# Altium schematic sheet 恒流驱动灯板.SchDoc
size A3
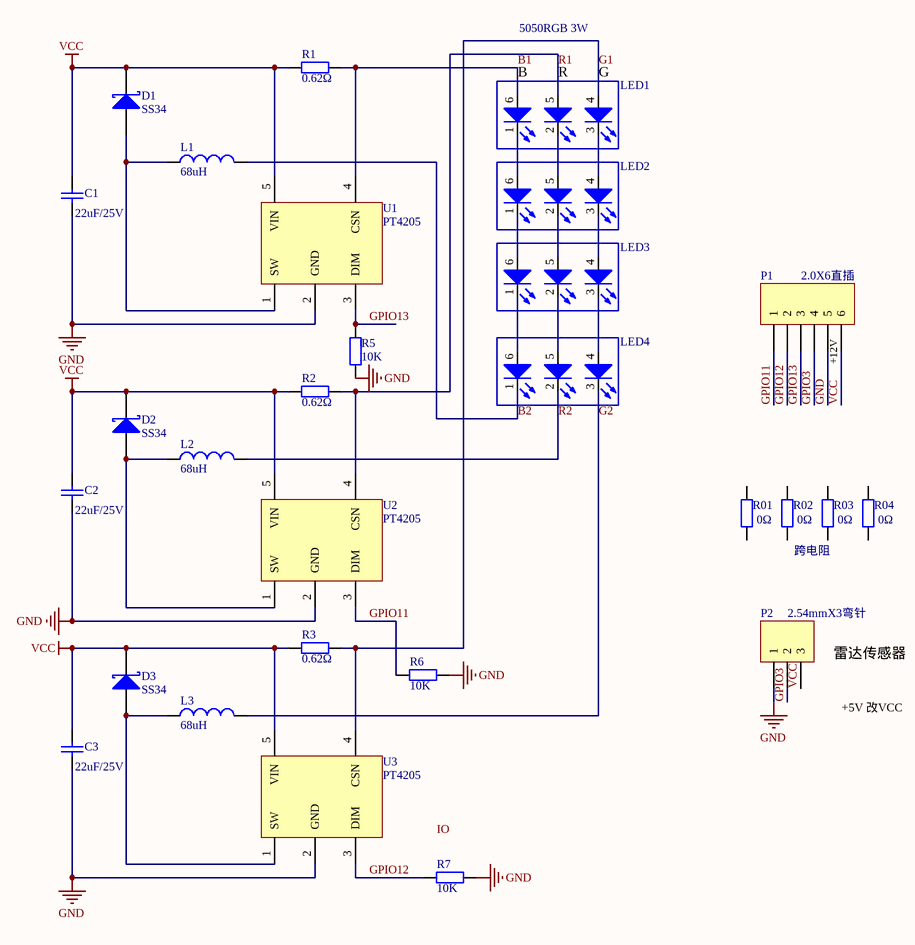
[diagram p0: 恒流驱动灯板.SchDoc]

## Parts
C1  22uF/25V  [1206]
C2  22uF/25V  [1206]
C3  22uF/25V  [1206]
D1  SS34  [SMA]
D2  SS34  [SMA]
D3  SS34  [SMA]
L1  68uH  [D电感 7X7mm]
L2  68uH  [D电感 7X7mm]
L3  68uH  [D电感 7X7mm]
LED1  5050RGB 3W  [LED 5050RGB 3W]
LED2  5050RGB 3W  [LED 5050RGB 3W]  (value not drawn)
LED3  5050RGB 3W  [LED 5050RGB 3W]  (value not drawn)
LED4  5050RGB 3W  [LED 5050RGB 3W]  (value not drawn)
P1  2.0X6直插  [2.54M6 贴焊]
P2  2.54mmX3弯针  [模块5.8G微波感应模 2]
R1  0.62Ω  [0805]
R01  0Ω  [1206]
R2  0.62Ω  [0805]
R02  0Ω  [1206]
R3  0.62Ω  [0805]
R03  0Ω  [1206]
R04  0Ω  Published: 跨电阻  [1206]
R5  10K  [0805]
R6  10K  [0805]
R7  10K  [0805]
U1  PT4205  [SOT-89-5L - 改]
U2  PT4205  [SOT-89-5L - 改]
U3  PT4205  [SOT-89-5L - 改]

## Nets
GND: C1.1 C2.1 C3.1 P1.5 P2.1 R5.2 R6.2 R7.2 U1.2(GND) U2.2(GND) U3.2(GND)
VCC: C1.2 C2.2 C3.2 D1.2(K) D2.2(K) D3.2(K) P1.6 P2.3 R1.1 R2.1 R3.1 U1.5(VIN) U2.5(VIN) U3.5(VIN)
B1: LED1.6 R1.2 U1.4(CSN)
B2: L1.2 LED4.1
G1: LED1.4 R3.2 U3.4(CSN)
G2: L3.2 LED4.3
GPIO3: P1.4 P2.2
GPIO11: P1.1 R6.1 U2.3(DIM)
GPIO12: P1.2 R7.1 U3.3(DIM)
GPIO13: P1.3 R5.1 U1.3(DIM)
R1: LED1.5 R2.2 U2.4(CSN)
R2: L2.2 LED4.2
NetD1_1: D1.1(A) L1.1 U1.1(SW)
NetD2_1: D2.1(A) L2.1 U2.1(SW)
NetD3_1: D3.1(A) L3.1 U3.1(SW)
NetLED1_1: LED1.1 LED2.6
NetLED1_2: LED1.2 LED2.5
NetLED1_3: LED1.3 LED2.4
NetLED2_1: LED2.1 LED3.6
NetLED2_2: LED2.2 LED3.5
NetLED2_3: LED2.3 LED3.4
NetLED3_1: LED3.1 LED4.6
NetLED3_2: LED3.2 LED4.5
NetLED3_3: LED3.3 LED4.4

Not connected (* = marked no-connect by the designer): R01 1 2; R02 1 2; R03 1 2; R04 1 2

## Notes on the sheet
- (near LED1) B
- (near LED1) R
- (near LED1) G
- (near P1) +12V
- (near P2) 雷达传感器
- +5V 改VCC
- Labels drawn without touching a wire or pin: IO

## Library data of the parts
C1-C3 = C: Published: 8-Jun-2000; LatestRevisionDate: 17-Jul-2002; LatestRevisionNote: Re-released for DXP Platform.; PackageReference: RAD-0.3; Publisher: Altium Limited; PackageDescription: Radial Cap, Thru-Hole; 2 Leads; 0.3 in Pin Spacing
D1-D3 = D稳压二极管: Published: 8-Jun-2000; LatestRevisionDate: 17-Jul-2002; LatestRevisionNote: Re-released for DXP Platform.; PackageReference: SMB; Publisher: Altium Limited; PackageDescription: DO-214-AA/SMB; 2 C-Bend Leads; Body 5.3 x 3.6 mm, inc. leads (LxW); Code_JEDEC: DO-214-AA
L1-L3 = D电感: Code_IEC: 1005; Published: 8-Jun-2000; LatestRevisionDate: 29-May-2009; LatestRevisionNote: IPC-7351 Footprint Added.; PackageReference: 0402-A; Publisher: Altium Limited; PackageDescription: Chip Inductor; Code_JEITA: 0402
LED1-LED4 = LED 5050RGB 3W: Published: 8-Jun-2000; LatestRevisionDate: 08-Jul-2005; LatestRevisionNote: Mech Layer 1 removed.; PackageReference: LED-1; Publisher: Altium Limited; PackageDescription: LED; 2 Leads
P1 = Header 6: Header, 6-Pin; LatestRevisionDate: 17-Jul-2002; LatestRevisionNote: Re-released for DXP Platform.; Publisher: Altium Limited
P2 = Header 3: Header, 3-Pin; LatestRevisionDate: 17-Jul-2002; LatestRevisionNote: Re-released for DXP Platform.; Publisher: Altium Limited
R1 R01 R2 R02 R3 R03 R04 = R1: LatestRevisionDate: 17-Jul-2002; LatestRevisionNote: Re-released for DXP Platform.; PackageReference: AXIAL-0.4; Publisher: Altium Limited; PackageDescription: Axial Device, Thru-Hole; 2 Leads; 0.4 in Pin Spacing
  R1 R01 R2 R02 R3 R03: Published: 8-Jun-2000
R5-R7 = R电阻1: Published: 8-Jun-2000; LatestRevisionDate: 17-Jul-2002; LatestRevisionNote: Re-released for DXP Platform.; PackageReference: AXIAL-0.4; Publisher: Altium Limited; PackageDescription: Axial Device, Thru-Hole; 2 Leads; 0.4 in Pin Spacing